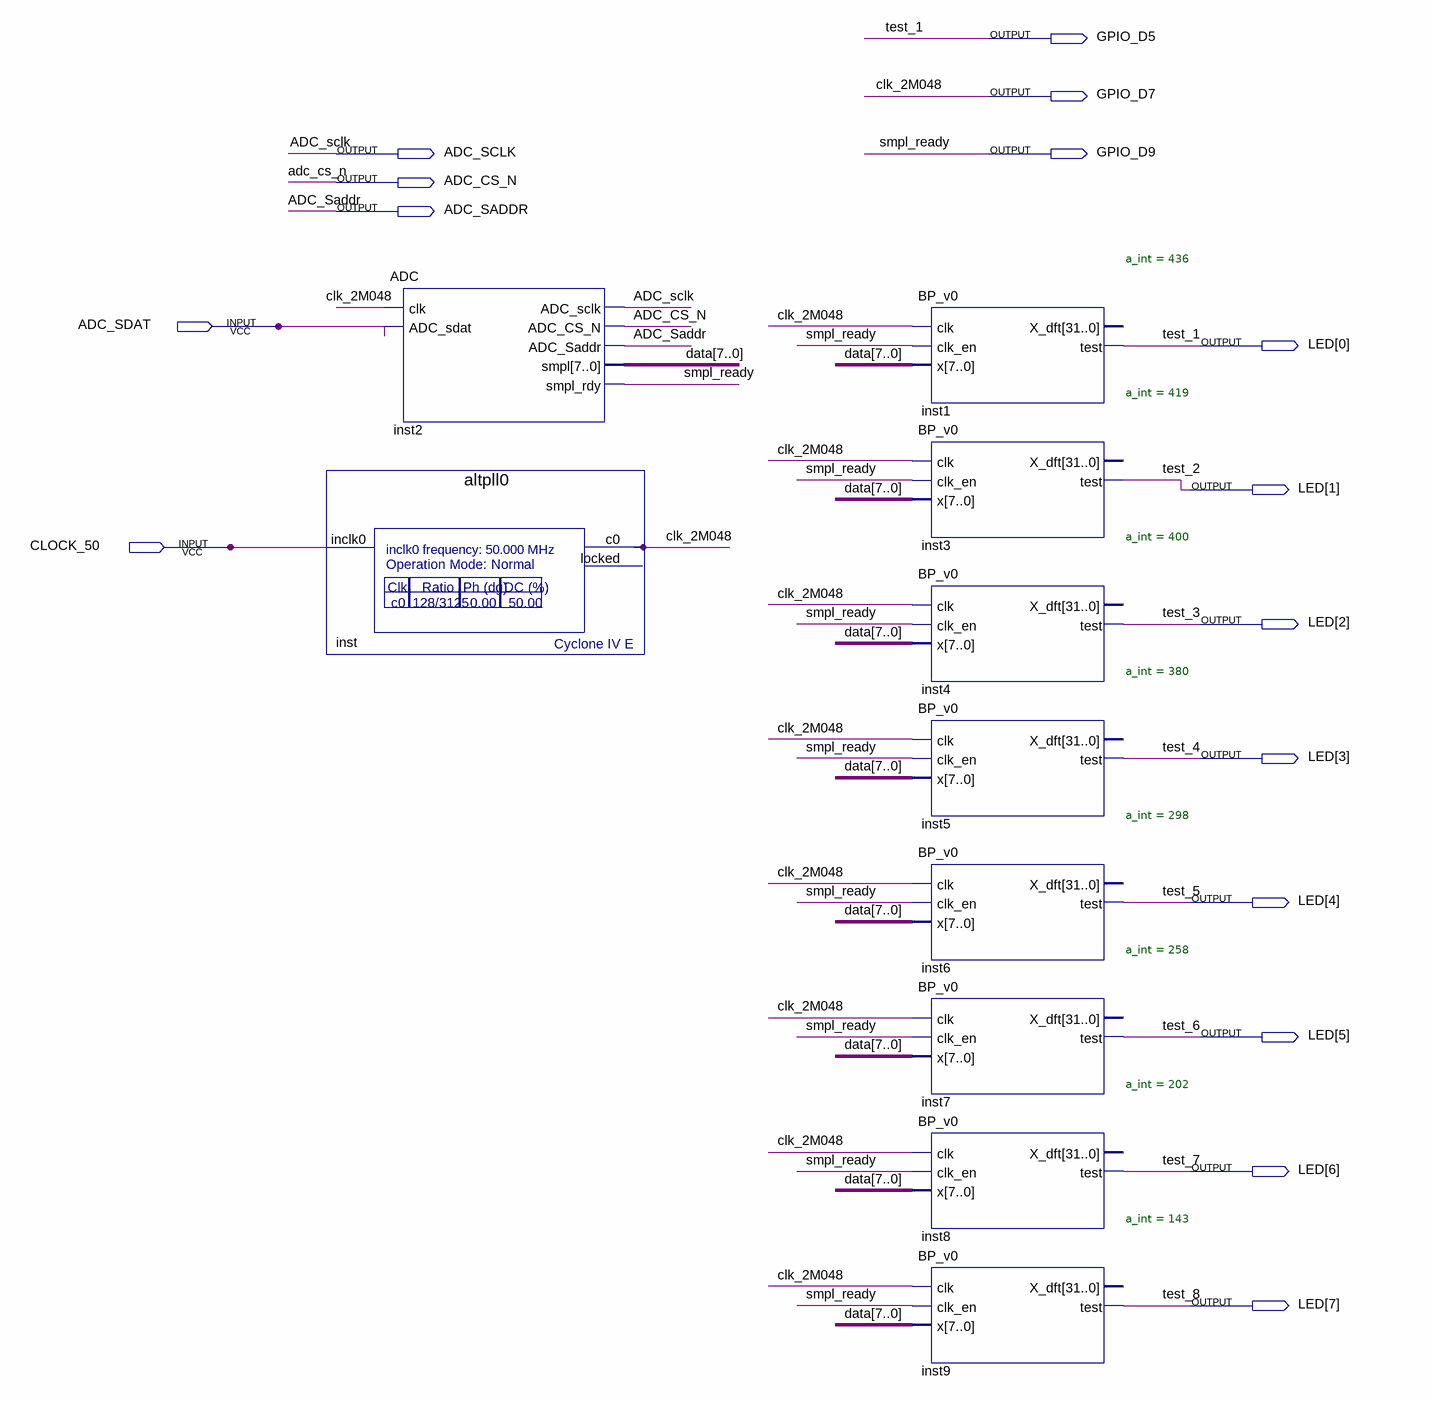
[diagram p0: schematic sheet]
// Quartus schematic main.bdf as structural Verilog: 10 symbols, 16 pins
module main (
  input  ADC_SDAT,
  input  CLOCK_50,
  output GPIO_D5,
  output GPIO_D7,
  output ADC_SCLK,
  output GPIO_D9,
  output ADC_CS_N,
  output ADC_SADDR,
  output [7:0] LED
);

  wire [7:0] data;

  ADC inst2 (
    .clk(GPIO_D7), .ADC_sdat(ADC_SDAT), .ADC_sclk(ADC_SCLK), .ADC_CS_N(ADC_CS_N), .ADC_Saddr(ADC_SADDR),
    .smpl(data), .smpl_rdy(GPIO_D9));
  altpll0 inst (.inclk0(CLOCK_50), .c0(GPIO_D7));  // open: locked
  BP_v0 #(.a_int(436)) inst1 (.clk(GPIO_D7), .clk_en(GPIO_D9), .x(data), .test(GPIO_D5));  // open: X_dft
  BP_v0 #(.a_int(419)) inst3 (.clk(GPIO_D7), .clk_en(GPIO_D9), .x(data), .test(LED[1]));  // open: X_dft
  BP_v0 #(.a_int(400)) inst4 (.clk(GPIO_D7), .clk_en(GPIO_D9), .x(data), .test(LED[2]));  // open: X_dft
  BP_v0 #(.a_int(380)) inst5 (.clk(GPIO_D7), .clk_en(GPIO_D9), .x(data), .test(LED[3]));  // open: X_dft
  BP_v0 #(.a_int(298)) inst6 (.clk(GPIO_D7), .clk_en(GPIO_D9), .x(data), .test(LED[4]));  // open: X_dft
  BP_v0 #(.a_int(258)) inst7 (.clk(GPIO_D7), .clk_en(GPIO_D9), .x(data), .test(LED[5]));  // open: X_dft
  BP_v0 #(.a_int(202)) inst8 (.clk(GPIO_D7), .clk_en(GPIO_D9), .x(data), .test(LED[6]));  // open: X_dft
  BP_v0 #(.a_int(143)) inst9 (.clk(GPIO_D7), .clk_en(GPIO_D9), .x(data), .test(LED[7]));  // open: X_dft

  assign LED[0] = GPIO_D5;

  // Other names for the same wires on the sheet: clk_2M048 = GPIO_D7; test_2 = LED[1]; smpl_ready = GPIO_D9;
  //   test_1 = GPIO_D5; test_3 = LED[2]; test_4 = LED[3]; test_5 = LED[4]; test_6 = LED[5]; test_7 = LED[6];
  //   test_8 = LED[7]
endmodule
